# Altium schematic sheet 14_RFPD_PoE_USB_PD.SchDoc: RF power detectors, PoE and USB PD
size A3; Organization: Lime Microsystems; Address1: Surrey Tech Centre; Address2: Guildford GU2 7YG; Address3: Surrey; Address4: United Kingdom; SheetNumber: 14
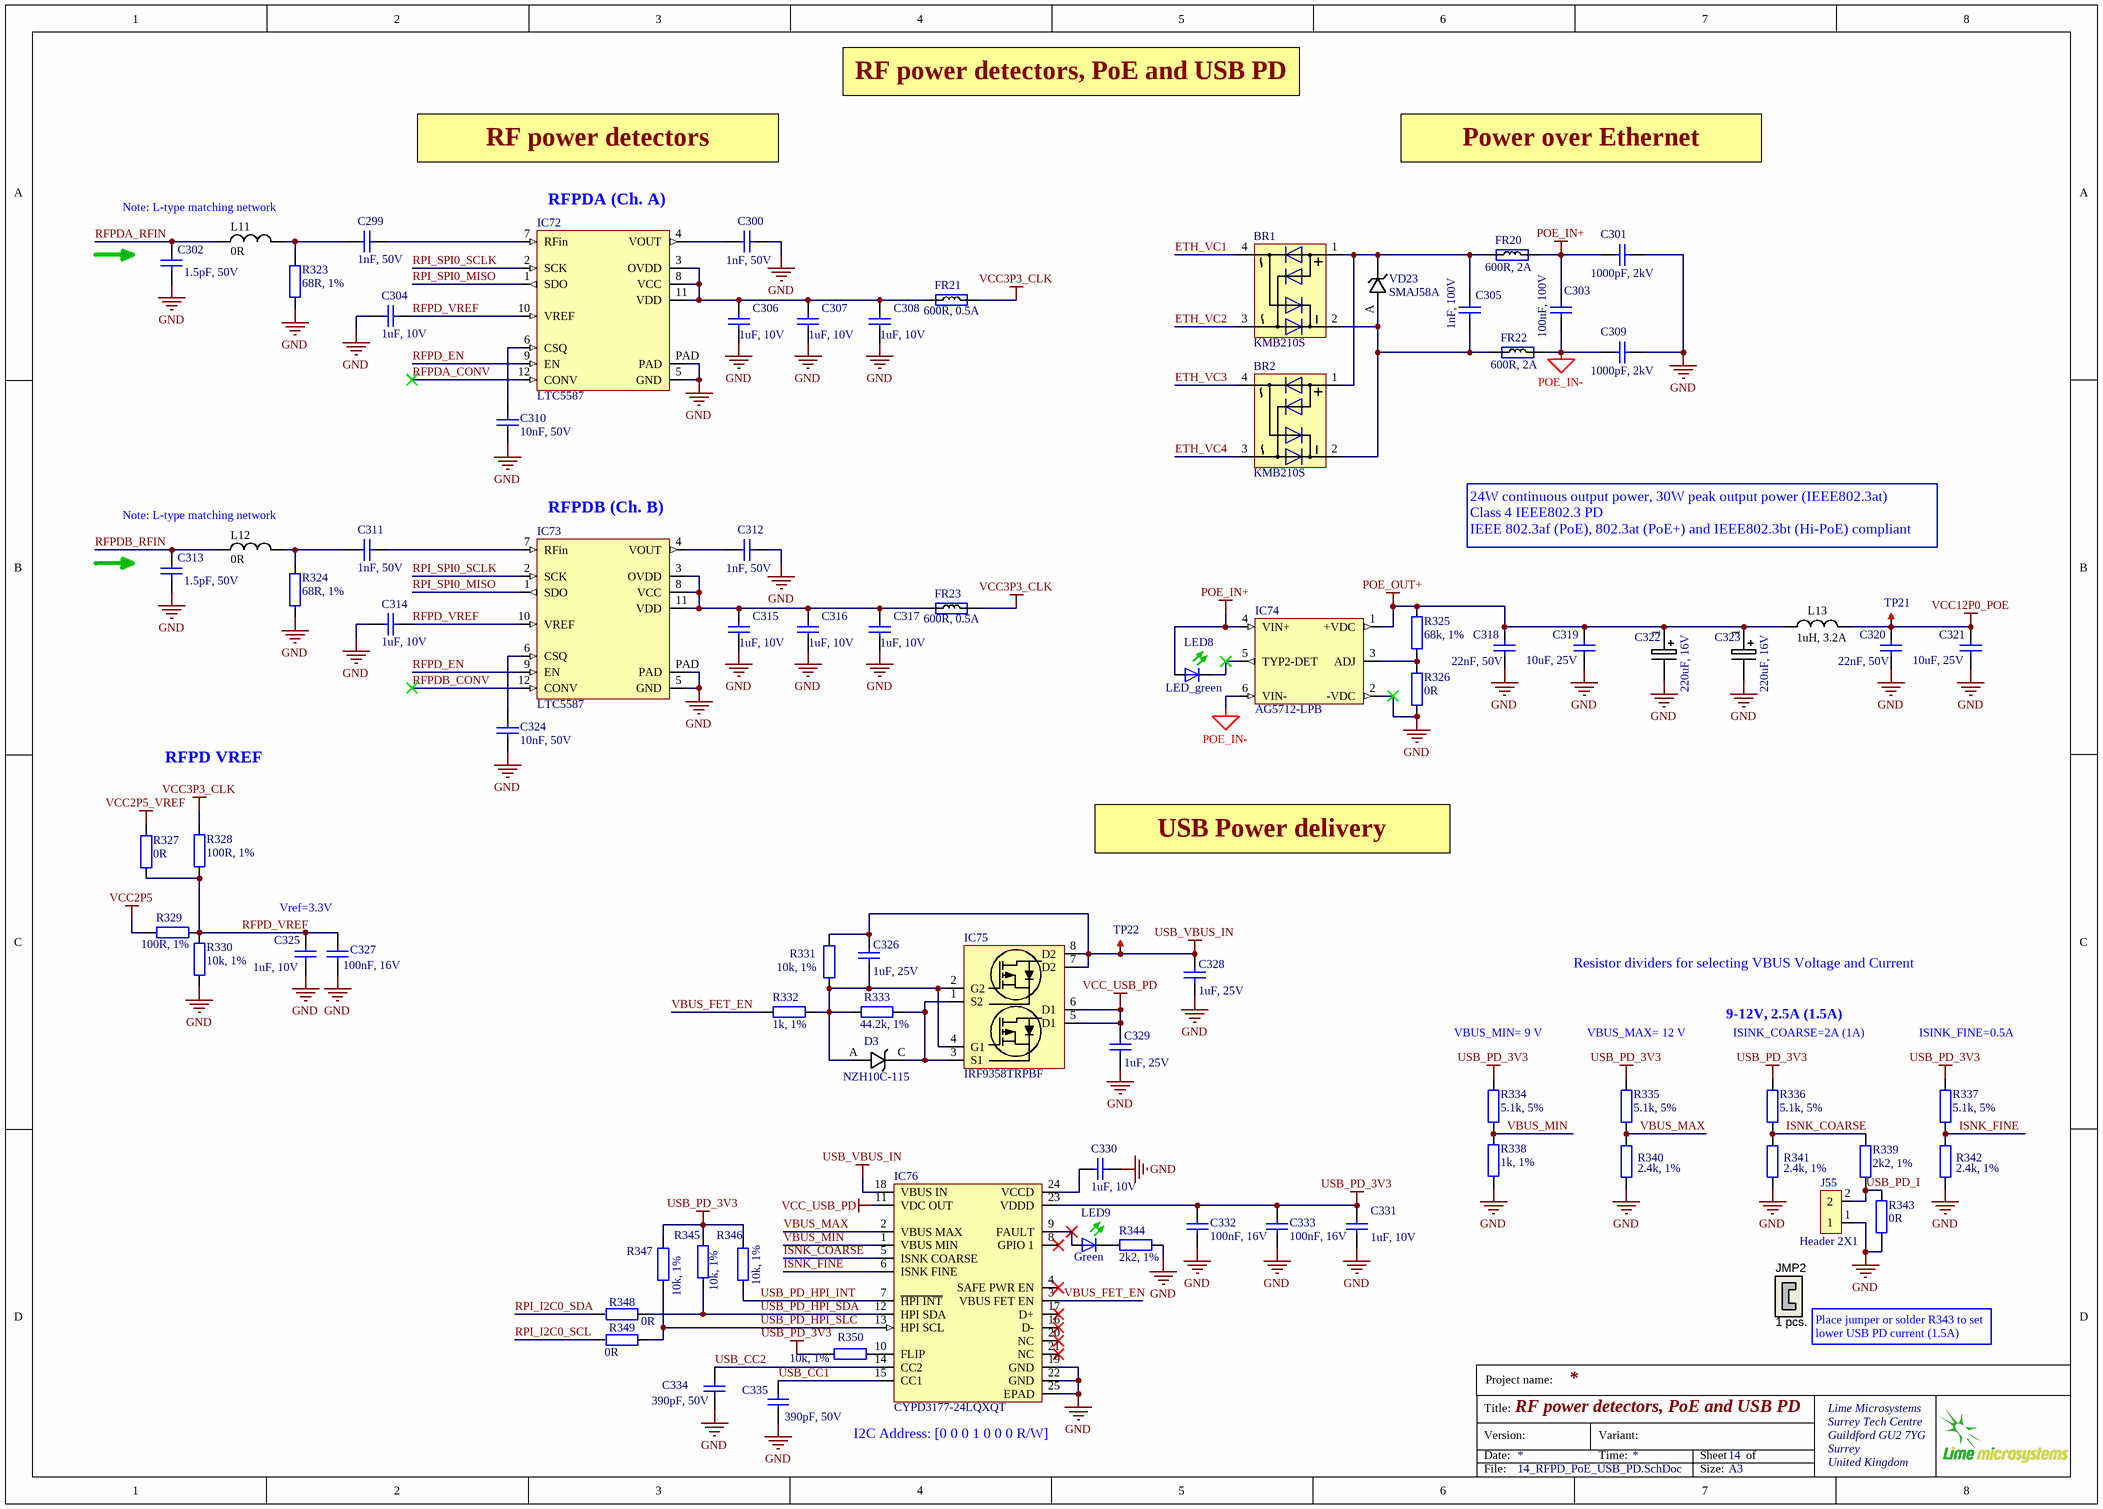
[diagram p0: 14_RFPD_PoE_USB_PD.SchDoc]

## Parts
BR1  KMB210S  [KMB210S_RECTIFIER_BRIDGE]
BR2  KMB210S  [KMB210S_RECTIFIER_BRIDGE]
C299  1nF, 50V  [CAP0402]
C300  1nF, 50V  [CAP0402]
C301  1000pF, 2kV  [CAP1812]
C302  1.5pF, 50V  [CAP0402]
C303  100nF, 100V  [CAP0603]
C304  1uF, 10V  [CAP0402]
C305  1nF, 100V  [CAP0603]
C306  1uF, 10V  [CAP0402]
C307  1uF, 10V  [CAP0402]
C308  1uF, 10V  [CAP0402]
C309  1000pF, 2kV  [CAP1812]
C310  10nF, 50V  [CAP0402]
C311  1nF, 50V  [CAP0402]
C312  1nF, 50V  [CAP0402]
C313  1.5pF, 50V  [CAP0402]
C314  1uF, 10V  [CAP0402]
C315  1uF, 10V  [CAP0402]
C316  1uF, 10V  [CAP0402]
C317  1uF, 10V  [CAP0402]
C318  22nF, 50V  [CAP0402]
C319  10uF, 25V  [CAP0805]
C320  22nF, 50V  [CAP0402]
C321  10uF, 25V  [CAP0805]
C322  220uF, 16V  [CAP_POL_SIZE_F_v2]
C323  220uF, 16V  [CAP_POL_SIZE_F_v2]
C324  10nF, 50V  [CAP0402]
C325  1uF, 10V  [CAP0402]
C326  1uF, 25V  [CAP0603]
C327  100nF, 16V  [CAP0402]
C328  1uF, 25V  [CAP0603]
C329  1uF, 25V  [CAP0603]
C330  1uF, 10V  [CAP0402]
C331  1uF, 10V  [CAP0402]
C332  100nF, 16V  [CAP0402]
C333  100nF, 16V  [CAP0402]
C334  390pF, 50V  [CAP0402]
C335  390pF, 50V  [CAP0402]
D3  NZH10C-115  [NZH10C,115_shottky_diode_SOD123]
FR20  600R, 2A  [RES0805]
FR21  600R, 0.5A  [RES0402]
FR22  600R, 2A  [RES0805]
FR23  600R, 0.5A  [RES0402]
IC72  LTC5587  [LTC5587_DFN12]
IC73  LTC5587  [LTC5587_DFN12]
IC74  AG5712-LPB  [AG5712-LPB_PoE_PD_module]
IC75  IRF9358TRPBF  [IRF9358TRPBF_DUAL_NMOS_SOIC8]
IC76  CYPD3177-24LQXQT  [USB_POWER_DISTR_CYPD3177_QFN24]
J55  Header 2X1  [HDR_1x2]
JMP2  1 pcs.  (mechanical)
L11  0R  [RES0402]
L12  0R  [RES0402]
L13  1uH, 3.2A  [NRS4018T3R3MDGJ_inductor]
LED8  LED_green  [LED-0603-GREEN]
LED9  Green  [LED-0603-GREEN]
R323  68R, 1%  [RES0402]
R324  68R, 1%  [RES0402]
R325  68k, 1%  [RES0402]
R326  0R  [RES0402]
R327  0R  [RES0402_v2]
R328  100R, 1%  [RES0402]
R329  100R, 1%  [RES0402]
R330  10k, 1%  [RES0402]
R331  10k, 1%  [RES0402]
R332  1k, 1%  [RES0402]
R333  44.2k, 1%  [RES0402]
R334  5.1k, 5%  [RES0402]
R335  5.1k, 5%  [RES0402]
R336  5.1k, 5%  [RES0402]
R337  5.1k, 5%  [RES0402]
R338  1k, 1%  [RES0402]
R339  2k2, 1%  [RES0402]
R340  2.4k, 1%  [RES0402]
R341  2.4k, 1%  [RES0402]
R342  2.4k, 1%  [RES0402]
R343  0R  [RES0402]
R344  2k2, 1%  [RES0402]
R345  10k, 1%  [RES0402]
R346  10k, 1%  [RES0402]
R347  10k, 1%  [RES0402]
R348  0R  [RES0402]
R349  0R  [RES0402]
R350  10k, 1%  [RES0402]
TP21  TESTPOINT_PAD  [TP_PAD_1p5MM]  (value not drawn)  (no BOM)
TP22  TESTPOINT_PAD  [TP_PAD_1p5MM]  (value not drawn)  (no BOM)
VD23  SMAJ58A  [SMAJ58A_shottky_diode]

## Nets
GND: C300.1 C301.1 C302.2 C304.2 C306.1 C307.1 C308.1 C309.1 C310.2 C312.1 C313.2 C314.2 C315.1 C316.1 C317.1 C318.2 C319.1 C320.2 C321.1 C322.2 C323.2 C324.2 C325.1 C327.2 C328.1 C329.1 C330.1 C331.1 C332.2 C333.2 C334.2 C335.2 IC72.5(GND) IC72.PAD IC73.5(GND) IC73.PAD IC74.2(-VDC) IC76.19(GND) IC76.22(GND) IC76.25(EPAD) J55.1 R323.2 R324.2 R326.2 R330.2 R338.2 R340.1 R341.1 R342.1 R343.2 R344.2
POE_IN+: C301.2 C303.2 FR20.2 IC74.4(VIN+) LED8.A
POE_IN-: C303.1 C309.2 FR22.2 IC74.6(VIN-)
POE_OUT+: C318.1 C319.2 C322.1 C323.1 IC74.1(+VDC) L13.1 R325.1
USB_PD_3V3: C331.2 C332.1 C333.1 IC76.23(VDDD) R334.1 R335.1 R336.1 R337.1 R345.2 R346.2 R347.2 R350.1
USB_VBUS_IN: C326.2 C328.2 IC75.7(D2) IC75.8(D2) IC76.18(VBUS_IN) R331.2 TP22.1
VCC2P5: R329.2
VCC2P5_VREF: R327.2
VCC3P3_CLK: FR21.2 FR23.2 R328.1
VCC12P0_POE: C320.1 C321.2 L13.2 TP21.1
VCC_USB_PD: C329.2 IC75.5(D1) IC75.6(D1) IC76.11(VDC_OUT)
ETH_VC1: BR1.4
ETH_VC2: BR1.3
ETH_VC3: BR2.4
ETH_VC4: BR2.3
ISNK_COARSE: IC76.5(ISNK_COARSE) R336.2 R339.2 R341.2
ISNK_FINE: IC76.6(ISNK_FINE) R337.2 R342.2
RFPD_EN: IC72.9(EN) IC73.9(EN)
RFPD_VREF: C304.1 C314.1 C325.2 C327.1 IC72.10(VREF) IC73.10(VREF) R327.1 R328.2 R329.1 R330.1
RFPDA_CONV: IC72.12(CONV)
RFPDA_RFIN: C302.1 L11.1
RFPDB_CONV: IC73.12(CONV)
RFPDB_RFIN: C313.1 L12.1
RPI_I2C0_SCL: R349.2
RPI_I2C0_SDA: R348.2
RPI_SPI0_MISO: IC72.1(SDO) IC73.1(SDO)
RPI_SPI0_SCLK: IC72.2(SCK) IC73.2(SCK)
USB_CC1: C335.1 IC76.15(CC1)
USB_CC2: C334.1 IC76.14(CC2)
USB_PD_HPI_INT: IC76.7(~{HPI_INT}) R346.1
USB_PD_HPI_SDA: IC76.12(HPI_SDA) R345.1 R348.1
USB_PD_HPI_SLC: IC76.13(HPI_SCL) R347.1 R349.1
USB_PD_I: J55.2 R339.1 R343.1
VBUS_FET_EN: IC76.3(VBUS_FET_EN) R332.2
VBUS_MAX: IC76.2(VBUS_MAX) R335.2 R340.2
VBUS_MIN: IC76.1(VBUS_MIN) R334.2 R338.1
NetBR1_1: BR1.1 BR2.1 C305.1 FR20.1 VD23.K
NetBR1_2: BR1.2 BR2.2 C305.2 FR22.1 VD23.A
NetC299_1: C299.1 L11.2 R323.1
NetC299_2: C299.2 IC72.7(RFin)
NetC300_2: C300.2 IC72.4(VOUT)
NetC306_2: C306.2 C307.2 C308.2 FR21.1 IC72.3(OVDD) IC72.8(VCC) IC72.11(VDD)
NetC310_1: C310.1 IC72.6(CSQ)
NetC311_1: C311.1 L12.2 R324.1
NetC311_2: C311.2 IC73.7(RFin)
NetC312_2: C312.2 IC73.4(VOUT)
NetC315_2: C315.2 C316.2 C317.2 FR23.1 IC73.3(OVDD) IC73.8(VCC) IC73.11(VDD)
NetC324_1: C324.1 IC73.6(CSQ)
NetC326_1: C326.1 D3.A IC75.2(G2) IC75.4(G1) R331.1 R332.1 R333.2
NetC330_2: C330.2 IC76.24(VCCD)
NetD3_C: D3.C IC75.1(S2) IC75.3(S1) R333.1
NetIC74_3: IC74.3(ADJ) R325.2 R326.1
NetIC74_5: IC74.5(TYP2-DET) LED8.K(C)
NetIC76_9: IC76.9(FAULT) LED9.A
NetIC76_10: IC76.10(FLIP) R350.2
NetLED9_K: LED9.K(C) R344.1

Not connected (* = marked no-connect by the designer): IC76 4(SAFE_PWR_EN)* 8(GPIO_1)* 16(D-)* 17(D+)* 20(NC)* 21(NC)*; JMP2 1 2

## Notes on the sheet
- RF power detectors, PoE and USB PD
- RF power detectors
- Power over Ethernet
- Note: L-type matching network
- (near IC72) RFPDA (Ch. A)
- (near IC73) RFPDB (Ch. B)
- 24W continuous output power, 30W peak output power (IEEE802.3at)
  Class 4 IEEE802.3 PD
  IEEE 802.3af (PoE), 802.3at (PoE+) and IEEE802.3bt (Hi-PoE) compliant
- RFPD VREF
- USB Power delivery
- Vref=3.3V
- Resistor dividers for selecting VBUS Voltage and Current
- (near R334) VBUS_MIN= 9 V
- (near R335) VBUS_MAX= 12 V
- 9-12V, 2.5A (1.5A)
- (near R336) ISINK_COARSE=2A (1A)
- (near R337) ISINK_FINE=0.5A
- Place jumper or solder R343 to set lower USB PD current (1.5A)
- (near IC76) I2C Address: [0 0 0 1 0 0 0 R/W]
- Project name:
- Title:
- Version:
- Date:
- Variant:
- Time:
- Sheet
- of
- File:
- Size:
- A3

## Library data of the parts
BR1 BR2 = KMB210S_RECTIFIER_BRIDGE: Part Description: Bridge Rectifier Single Phase Schottky 100 V Surface Mount MBS; Manufacturer: SMC Diode Solutions; Manufacturer Part Number 1: KMB210S; Supplier Part Number 1: 1655-KMB210SCT-ND; Supplier 1: Digi-Key
C299 C300 C311 C312 = Cap_0402: Manufacturer: Murata Electronics North America; Part Description: 1000pF ±10% 50V Ceramic Capacitor X7R 0402 (1005 Metric); Manufacturer Part Number 1: GCM155R71H102KA37D; Temperature Coefficient: X7R; Tolerance: ±10%; Height - Seated (Max): -; Operating Temperature: -55°C ~ 125°C; Ratings: AEC-Q200; Package / Case: 0402 (1005 Metric); Lead Style: -; Size / Dimension: 0.039" L x 0.020" W (1.00mm x 0.50mm); Lead Spacing: -; Thickness (Max): 0.022" (0.55mm); Mounting Type: Surface Mount, MLCC; Features: -; Voltage - Rated: 50V; Applications: Automotive; Part Status: Active; Packaging: Cut Tape (CT); RoHS: RoHS Compliant; Category: Capacitors; Supplier Part Number 1: 490-4761-1-ND; Supplier 1: Digi-Key; Value: 1nF, 50V
C301 C309 = Cap_1206: Manufacturer Part Number 1: C1812C102KGRACTU; Manufacturer: KEMET; Part Description: 1000pF ±10% 2000V (2kV) Ceramic Capacitor X7R 1812 (4532 Metric); Manufacturer Part Number: C1812C102KGRACAUTO; Tolerance: ±10%; Notification: Current market demand for these product types have resulted in fluctuating and extending lead times. Lead times may differ.; Voltage - Rated: 2000V (2kV); Temperature Coefficient: X7R; Dielectric Material: Ceramic; Capacitance: 1nF; Packaging: Cut Tape (CT); Supplier Part Number 1: 399-3447-1-ND; Supplier 1: Digi-Key; Part Status: Active; Category: Capacitors; RoHS: RoHS Compliant; Mounting Type: Surface Mount, MLCC; Applications: General Purpose; Lead Style: -; Ratings: -; Height - Seated (Max): -; Thickness (Max): 0.061" (1.55mm); Size / Dimension: 0.177" L x 0.126" W (4.50mm x 3.20mm); Package / Case: 1812 (4532 Metric); Failure Rate: -; Lead Spacing: -; Features: High Voltage; Operating Temperature: -55°C ~ 125°C; Value: 1000pF, 2kV; Supplier 2: Digi-Key; Supplier Part Number 2: 399-16774-1-ND; Stock 2: 4004; Pricing 2: 1=0.51, 10=0.355, 100=0.2132, 500=0.1599 (USD); Case/Package: 1812; Weight: 0.000952oz; Case Code (Imperial): 1812; Case Code (Metric): 4532; Min Operating Temperature: -55°C; Max Operating Temperature: 125°C; Voltage Rating (DC): 2kV; Dielectric: X7R; Termination: SMD/SMT; Length: 4.5mm; Width: 3.2mm
C302 C313 = Cap_0402: Manufacturer: Murata; Manufacturer Part Number 1: GRM1555C1H1R5BA01D; Value: 1.5pF, 50V; Supplier 1: Digikey; Supplier Part Number 1: 490-6212-1-ND; Stock 1: 154540; Pricing 1: 1=0,1, 10=0,028, 100=0,0174, 1000=0,01177, 2500=0,01026, 5000=0,0093 (USD); RoHS: Yes; Lead Free: 5697LeadFree; ComponentLink1URL: https://datasheet.ciiva.com/6270/grm1555c1h1r5ba01-01-6270901.pdf?src-supplier=Digikey; ComponentLink1Description: https://datasheet.ciiva.com/6270/grm1555c1h1r5ba01-01-6270901.pdf?src-supplier=Digikey; ComponentLink2URL: https://datasheet.ciiva.com/6270/partnumbering-e-01-6270904.pdf?src-supplier=Digikey; ComponentLink2Description: https://datasheet.ciiva.com/6270/partnumbering-e-01-6270904.pdf?src-supplier=Digikey; ComponentLink3URL: https://datasheet.ciiva.com/6270/partnumbering-e-01-6270907.pdf?src-supplier=Digikey; ComponentLink3Description: https://datasheet.ciiva.com/6270/partnumbering-e-01-6270907.pdf?src-supplier=Digikey; ComponentLink4URL: https://datasheet.ciiva.com/11615/product-11615786.pdf?src-supplier=Avnet; ComponentLink4Description: https://datasheet.ciiva.com/11615/product-11615786.pdf?src-supplier=Avnet
C303 = Cap_0603: Manufacturer: Murata Electronics North America; Manufacturer Part Number 1: GRM188R72A104KA35D; Part Description: 0.1µF ±10% 100V Ceramic Capacitor X7R 0603 (1608 Metric); Temperature Coefficient: X7R; Tolerance: ±10%; Notification: Current market demand for these product types have resulted in fluctuating and extending lead times. Lead times may differ.; Value: 100nF, 100V; RoHS: RoHS Compliant; Packaging: Cut Tape (CT); Lead Spacing: -; Voltage - Rated: 100V; Package / Case: 0603 (1608 Metric); Category: Capacitors; Supplier 1: Digi-Key; Applications: General Purpose; Ratings: -; Part Status: Not For New Designs; Operating Temperature: -55°C ~ 125°C; Lead Style: -; Size / Dimension: 0.063" L x 0.031" W (1.60mm x 0.80mm); Supplier Part Number 1: 490-3285-1-ND; Height - Seated (Max): -; Features: -; Thickness (Max): 0.035" (0.90mm); Mounting Type: Surface Mount, MLCC
C304 C306-C308 C314-C317 C325 C330 C331 = Cap_0402: CAP CER 1UF 10V X5R 0402; Manufacturer: Yageo; Part Description: 1µF 10V Ceramic Capacitor X5R 0402 (1005 Metric) 0.039" L x 0.020" W (1.00mm x 0.50mm); Manufacturer Part Number 1: CC0402MRX5R6BB105; Notification: Current market demand for these product types have resulted in fluctuating and extending lead times. Lead times may differ.; Tolerance: ±20%; Value: 1uF, 10V; Supplier 1: Digi-Key; Supplier Part Number 1: 311-1732-1-ND; RoHS: RoHS Compliant; Applications: General Purpose; Category: Capacitors; ComponentLink1Description: http://www.yageo.com/documents/recent/UPY-GPHC_X5R_4V-to-50V_25.pdf; ComponentLink1URL: http://www.yageo.com/documents/recent/UPY-GPHC_X5R_4V-to-50V_25.pdf; Failure Rate: -; Features: -; Height - Seated (Max): -; Lead Spacing: -; Lead Style: -; Mounting Type: Surface Mount, MLCC; Operating Temperature: -55°C ~ 85°C; Package / Case: 0402 (1005 Metric); Packaging: Cut Tape (CT); Part Status: Active; Pricing 1: 1=0.22, 10=0.156, 100=0.0732, 500=0.0513, 1000=0.04248, 2500=0.03953, 5000=0.03617 (USD); Ratings: -; Size / Dimension: 0.039" L x 0.020" W (1.00mm x 0.50mm); Stock 1: 69600; Temperature Coefficient: X5R; Thickness (Max): 0.022" (0.55mm); Voltage - Rated: 10V
C305 = Cap_0603: Manufacturer: KEMET; Manufacturer Part Number 1: C0603C102K1RACTU; Part Description: 1000pF ±10% 100V Ceramic Capacitor X7R 0603 (1608 Metric); Tolerance: 10%; Dielectric: X7R; Dielectric Material: Ceramic; Value: 1nF, 100V; Radiation Hardening: No; Length: 1.6mm; Mount: Surface Mount; Case/Package: 0603; Width: 0.8mm; Height: 0.8mm; Dissipation Factor: 10%; Package Quantity: 1; Lead Pitch: 0.7mm; Voltage: 100V; Voltage Rating: 100V; Case Code (Metric): 1608; Termination: SMD/SMT; Thickness: 0.034inch; REACH SVHC: No SVHC; Supplier Part Number 1: 399-7831-2-ND; Min Operating Temperature: -55°C; Voltage Rating (DC): 100V; Case Code (Imperial): 0603; Number of Pins: 2; Packaging: Tape and Reel; Capacitance: 1nF; Max Operating Temperature: 125°C; Supplier 1: Digi-Key; Depth: 0.8mm
C310 C324 = Cap_0603: Part Description: 10000pF ±10% 50V X7R Ceramic Capacitor -55°C ~ 125°C Surface Mount, MLCC 0402 (1005 Metric) 0.039" L x 0.020" W (1.00mm x 0.50mm); Manufacturer: Yageo; Tolerance: ±10%; Capacitance: 10000pF; Supplier 1: Digi-Key; Supplier Part Number 1: 311-1349-2-ND; Category: Capacitors; Package / Case: 0402 (1005 Metric); Voltage - Rated: 50V; Value: 10nF, 50V; Manufacturer Part Number 1: *
C318 C320 = Cap_0402: Manufacturer: Kemet; Manufacturer Part Number 1: C0402C223K5RACTU; Part Description: 0.022µF ±10% 50V X7R Ceramic Capacitor -55°C ~ 125°C Surface Mount, MLCC 0402 (1005 Metric) 0.039" L x 0.020" W (1.00mm x 0.50mm); Temperature Coefficient: X7R; Tolerance: ±10%; Capacitance: 0.022µF; Value: 22nF, 50V; Supplier 1: Digi-Key; Supplier Part Number 1: 399-7780-1-ND; Ratings: -; Packaging: Cut Tape (CT); Category: Capacitors; Size / Dimension: 0.039" L x 0.020" W (1.00mm x 0.50mm); RoHS: RoHS Compliant; Operating Temperature: -55°C ~ 125°C; Mounting Type: Surface Mount, MLCC; Applications: General Purpose; Voltage - Rated: 50V; Thickness (Max): 0.022" (0.55mm); Features: -; Height - Seated (Max): -; Lead Style: -; Package / Case: 0402 (1005 Metric); Lead Spacing: -
C319 C321 = Cap_0603: Part Description: CAP CER 10UF 25V X5R 0805; Manufacturer: Murata; Manufacturer Part Number 1: GRM21BR61E106KA73K; Tolerance: 10%; Dielectric: X5R; value: 10uF, 25V; Supplier 1: Digi-Key; Supplier Part Number 1: 490-16824-1-ND; Stock 1: 781136; Pricing 1: 1=0,19, 10=0,13, 50=0,0778, 100=0,0656, 500=0,0449, 1000=0,03972, 2500=0,038, 5000=0,03454 (USD); RoHS: Yes; Mount: Surface Mount; Case/Package: 0805; Weight: 0.000335oz; Case Code (Imperial): 0805; Case Code (Metric): 2012; Min Operating Temperature: -55°C; Max Operating Temperature: 85°C; Packaging: Tape and Reel; Capacitance: 10uF; Voltage Rating: 25V; Package Quantity: 10000; Voltage Rating (DC): 25V; Series: GRM; Length: 0.079inch; Width: 0.049inch; Thickness: 0.055inch; RoHS Compliant: Yes; ComponentLink1URL: http://www.mouser.com/ds/2/281/c02e-2905.pdf?src-supplier=Mouser; ComponentLink1Description: http://www.mouser.com/ds/2/281/c02e-2905.pdf?src-supplier=Mouser; ComponentLink2URL: http://search.murata.co.jp/Ceramy/image/img/A01X/G101/ENG/GRM21BR61E106KA73-01.pdf?src-supplier=Digi-Key; ComponentLink2Description: http://search.murata.co.jp/Ceramy/image/img/A01X/G101/ENG/GRM21BR61E106KA73-01.pdf?src-supplier=Digi-Key; ComponentLink3URL: https://search.murata.co.jp/Ceramy/image/img/A01X/G101/ENG/GRM21BR61E106KA73-01.pdf?src-supplier=Digi-Key; ComponentLink3Description: https://search.murata.co.jp/Ceramy/image/img/A01X/G101/ENG/GRM21BR61E106KA73-01.pdf?src-supplier=Digi-Key
C322 C323 = Cap_ceramic: Part Description: 220 µF 16 V Aluminum - Polymer Capacitors Radial, Can - SMD 30mOhm 5000 Hrs @ 105°C; Manufacturer: Kyocera AVX; Manufacturer Part Number 1: APA0609221M016R; Value: 220uF, 16V; ComponentLink1URL: http://components.arrow.com/part/dataview/41677645S8110057N1386; ComponentLink1Description: http://components.arrow.com/part/dataview/41677645S8110057N1386; ComponentLink2URL: https://www.distrelec.biz/Web/Downloads/_t/ds/PAN-FK_eng_tds.pdf?mime=application%2Fpdf; ComponentLink2Description: https://www.distrelec.biz/Web/Downloads/_t/ds/PAN-FK_eng_tds.pdf?mime=application%2Fpdf; ComponentLink3URL: http://uk.rs-online.com/webdocs/139e/0900766b8139e40f.pdf; ComponentLink3Description: http://uk.rs-online.com/webdocs/139e/0900766b8139e40f.pdf; ComponentLink4URL: http://www.alliedelec.com/m/d/e9dd47fa10a053d1f2828ce8bc944f54.pdf; ComponentLink4Description: http://www.alliedelec.com/m/d/e9dd47fa10a053d1f2828ce8bc944f54.pdf; ComponentLink5URL: https://industrial.panasonic.com/cdbs/www-data/pdf/RDE0000/ABA0000C1181.pdf; ComponentLink5Description: https://industrial.panasonic.com/cdbs/www-data/pdf/RDE0000/ABA0000C1181.pdf; ComponentLink6URL: http://www.farnell.com/datasheets/2002520.pdf; ComponentLink6Description: http://www.farnell.com/datasheets/2002520.pdf; ComponentLink7URL: http://industrial.panasonic.com/www-data/pdf/ABA0000/ABA0000CE120.pdf; ComponentLink7Description: http://industrial.panasonic.com/www-data/pdf/ABA0000/ABA0000CE120.pdf; ComponentLink8URL: http://www.farnell.com/datasheets/731857.pdf; ComponentLink8Description: http://www.farnell.com/datasheets/731857.pdf; ComponentLink9URL: http://www.produktinfo.conrad.com/datenblaetter/425000-449999/443507-da-01-en-SMD_ELKO_VFK_F_22_UF_100V.pdf; ComponentLink9Description: http://www.produktinfo.conrad.com/datenblaetter/425000-449999/443507-da-01-en-SMD_ELKO_VFK_F_22_UF_100V.pdf; ComponentLink10URL: https://industrial.panasonic.com/cdbs/www-data/pdf/RDE0000/DME0000COL90.pdf; ComponentLink10Description: https://industrial.panasonic.com/cdbs/www-data/pdf/RDE0000/DME0000COL90.pdf; ComponentLink11URL: http://www.industrial.panasonic.com/www-data/pdf/ABA0000/ABA0000CE2.pdf; ComponentLink11Description: http://www.industrial.panasonic.com/www-data/pdf/ABA0000/ABA0000CE2.pdf; ComponentLink12URL: http://www.mouser.com/ds/2/315/ABA0000C1145-947633.pdf; ComponentLink12Description: http://www.mouser.com/ds/2/315/ABA0000C1145-947633.pdf; ComponentLink13URL: http://www.farnell.com/datasheets/2648708.pdf; ComponentLink13Description: http://www.farnell.com/datasheets/2648708.pdf; ComponentLink14URL: http://industrial.panasonic.com/www-data/pdf/ABA0000/ABA0000CE2.pdf; ComponentLink14Description: http://industrial.panasonic.com/www-data/pdf/ABA0000/ABA0000CE2.pdf; ComponentLink15URL: http://www.farnell.com/datasheets/1880501.pdf?src-supplier=Farnell; ComponentLink15Description: http://www.farnell.com/datasheets/1880501.pdf?src-supplier=Farnell; ComponentLink16URL: http://www.farnell.com/datasheets/1880501.pdf?src-supplier=Element14; ComponentLink16Description: http://www.farnell.com/datasheets/1880501.pdf?src-supplier=Element14; ComponentLink17URL: https://katalog.we-online.de/pbs/datasheet/875105344010.pdf?src-supplier=Digi-Key; ComponentLink17Description: https://katalog.we-online.de/pbs/datasheet/875105344010.pdf?src-supplier=Digi-Key; ComponentLink18URL: http://katalog.we-online.de/pbs/datasheet/875105344010.pdf?src-supplier=Digi-Key; ComponentLink18Description: http://katalog.we-online.de/pbs/datasheet/875105344010.pdf?src-supplier=Digi-Key; Supplier 1: Digikey; Supplier Part Number 1: 478-APA0609221M016RCT-ND; Stock 1: 757; Pricing 1: 1=0,59, 10=0,352, 50=0,258, 100=0,2288 (USD); RoHS: No
C326 C328 C329 = Cap_0603: Manufacturer: Samsung Electro-Mechanics; Manufacturer Part Number 1: CL10A105KA8NNNC; Part Description: 1µF ±10% 25V Ceramic Capacitor X5R 0603 (1608 Metric); Notification: Current market demand for these product types have resulted in fluctuating and extending lead times. Lead times may differ.; Temperature Coefficient: X5R; Tolerance: ±10%; Lead Spacing: -; Lead Style: -; Thickness (Max): 0.035" (0.90mm); Features: -; Operating Temperature: -55°C ~ 85°C; Size / Dimension: 0.063" L x 0.031" W (1.60mm x 0.80mm); Height - Seated (Max): -; Applications: General Purpose; Mounting Type: Surface Mount, MLCC; Package / Case: 0603 (1608 Metric); Ratings: -; Supplier Part Number 1: 1276-1102-1-ND; Packaging: Cut Tape (CT); Voltage - Rated: 25V; RoHS: RoHS Compliant; Supplier 1: Digi-Key; Category: Capacitors; Part Status: Active; Value: 1uF, 25V
C327 = Cap_0603: Manufacturer Part Number 1: GRM155R71C104KA88D; Part Description: 0.10µF ±10% 16V Ceramic Capacitor X7R 0402 (1005 Metric); Brand: Murata Electronics; Tolerance: 10 %; Type: General Purpose MLCC; Capacitance: 0.1 uF; Temperature Coefficient / Code: +/- 15 %; Case Height: 0.5 mm; Case Length: 1 mm; Dielectric: X7R; Supplier 1: Mouser; Supplier Part Number 1: 81-GRM155R71C104KA88; Case Code - in: 0402; Manufacturer: Murata Electronics; Category: Multilayer Ceramic Capacitors MLCC - SMD/SMT; Voltage Rating DC: 16 V; Value: 100nF, 16V; Manufacturer Part Number: GRM155R71C104KA88D; Case Code - mm: 1005; Case Width: 0.5 mm; Maximum Operating Temperature: + 125 C; Minimum Operating Temperature: - 55 C; Minimum Order Quantity: 1; Operating Temperature Range: - 55 C to + 125 C; Package / Case: 0402 (1005 metric); Packaging: Reel; Product: General Type MLCCs; Product Category: Low & Medium Capacitance SMD Ceramic Chip Capacitors; Reeling: True; RoHS - Mouser: Y; RoHS: RoHS Compliant; Series: GRM; Standard Pack Qty: 10000; Termination Style: SMD/SMT
C332 C333 = Cap_0603: Manufacturer Part Number 1: GRM155R71C104KA88D; Part Description: 0.10µF ±10% 16V Ceramic Capacitor X7R 0402 (1005 Metric); Brand: Murata Electronics; Tolerance: 10 %; Type: General Purpose MLCC; Capacitance: 0.1 uF; Temperature Coefficient / Code: +/- 15 %; Supplier 1: Mouser; Supplier Part Number 1: 81-GRM155R71C104KA88; Case Code - in: 0402; Manufacturer: Murata Electronics; Category: Multilayer Ceramic Capacitors MLCC - SMD/SMT; Voltage Rating DC: 16 V; Value: 100nF, 16V; Maximum Operating Temperature: + 125 C; Minimum Operating Temperature: - 55 C; Minimum Order Quantity: 1; Operating Temperature Range: - 55 C to + 125 C; Package / Case: 0402 (1005 metric); Packaging: Reel; Product: General Type MLCCs; Product Category: Low & Medium Capacitance SMD Ceramic Chip Capacitors; Reeling: True; RoHS - Mouser: Y; RoHS: RoHS Compliant; Series: GRM; Standard Pack Qty: 10000; Termination Style: SMD/SMT; Manufacturer Part Number: GRM155R71C104KA88D
C334 C335 = Cap_0402: Manufacturer: Samsung; Manufacturer Part Number 1: CL05B391KB5NNNC; Part Description: 390 pF ±10% 50V Ceramic Capacitor X7R 0402 (1005 Metric); Tolerance: 10%; Dielectric: X7R; Value: 390pF, 50V; Supplier 1: Digi-Key; Supplier Part Number 1: 1276-1560-1-ND; Stock 1: 1313447; Pricing 1: 1=0,10000, 10=0,03400, 50=0,01860, 100=0,01520, 500=0,01088, 1000=0,00855, 2500=0,00778, 5000=0,00715 (USD); RoHS: Yes; Mount: Surface Mount; Case/Package: 0402; Case Code (Metric): 1005; Case Code (Imperial): 0402; Min Operating Temperature: -55°C; Max Operating Temperature: 125°C; Packaging: Tape and Reel; Capacitance: 390pF; Package Quantity: 1; Voltage Rating: 50V; Voltage: 50V; Series: CL; Construction: Flat; Length: 1mm; Width: 0.02inch; Height: 0.5mm; Thickness: 0.022inch; Depth: 0.5mm; Radiation Hardening: No; RoHS Compliant: Yes; ComponentLink1URL: https://datasheet.ciiva.com/25738/cl05b391kb5nnnc-25738709.pdf?src-supplier=Digi-Key; ComponentLink1Description: https://datasheet.ciiva.com/25738/cl05b391kb5nnnc-25738709.pdf?src-supplier=Digi-Key; ComponentLink2URL: https://datasheet.ciiva.com/26838/getdatasheetpartid-660062-26838242.pdf?src-supplier=Verical; ComponentLink2Description: https://datasheet.ciiva.com/26838/getdatasheetpartid-660062-26838242.pdf?src-supplier=Verical; ComponentLink3URL: https://datasheet.ciiva.com/16202/cl05b104kq5nnnc-16202591.pdf?src-supplier=Future+Electronics; ComponentLink3Description: https://datasheet.ciiva.com/16202/cl05b104kq5nnnc-16202591.pdf?src-supplier=Future+Electronics
D3 = MMSZ5245B_shottky_diode: Part Description: DIODE ZENER 10V 500MW SOD123F; Manufacturer: Nexperia; Manufacturer Part Number 1: NZH10C,115; ComponentLink1URL: http://www.mouser.com/ds/2/427/mmsz5225-102133.pdf; ComponentLink1Description: http://www.mouser.com/ds/2/427/mmsz5225-102133.pdf; ComponentLink2URL: https://datasheet.ciiva.com/331/littelfuse-tvs-diode-smbj-datasheet-pdf-331299.pdf?src-supplier=Digi-Key; ComponentLink2Description: https://datasheet.ciiva.com/331/littelfuse-tvs-diode-smbj-datasheet-pdf-331299.pdf?src-supplier=Digi-Key; ComponentLink3URL: https://datasheet.ciiva.com/331/littelfuse-tvs-diode-smbj-datasheet-pdf-331300.pdf?src-supplier=Digi-Key; ComponentLink3Description: https://datasheet.ciiva.com/331/littelfuse-tvs-diode-smbj-datasheet-pdf-331300.pdf?src-supplier=Digi-Key; ComponentLink4URL: https://datasheet.ciiva.com/331/littelfuse-tvs-diode-smbj-datasheet-pdf-331301.pdf?src-supplier=Digi-Key; ComponentLink4Description: https://datasheet.ciiva.com/331/littelfuse-tvs-diode-smbj-datasheet-pdf-331301.pdf?src-supplier=Digi-Key; Supplier 1: Digi-Key; Supplier Part Number 1: 1727-5057-1-ND; Stock 1: 6768; Pricing 1: 1=0,27000, 10=0,22200, 100=0,11780, 500=0,07752, 1000=0,05271 (USD); RoHS: Yes; RoHS Compliant: Yes; ComponentLink5URL: http://www.farnell.com/datasheets/1508365.pdf?src-supplier=Farnell; ComponentLink5Description: http://www.farnell.com/datasheets/1508365.pdf?src-supplier=Farnell
FR20 FR22 = Ferrite: Manufacturer Part Number 1: MPZ2012S601AT000; Manufacturer: TDK Corporation; Part Description: FERRITE BEAD 600 OHM 0805 1LN; Filter Type: Differential Mode - Single; Impedance @ Frequency: 600 Ohm @ 100MHz; DC Resistance (DCR): 100 mOhm Max; Supplier 1: Digi-Key; Supplier Part Number 1: 445-2206-2-ND; Mounting Type: Surface Mount; RoHS: RoHS Compliant; Height (Max): 0.041" (1.05mm); Packaging: Tape & Reel (TR); Category: Filters; Current Rating: 2A; Package / Case: 0805 (2012 Metric); Size / Dimension: 0.079" L x 0.049" W (2.00mm x 1.25mm); Value: 600R, 2A
FR21 FR23 = Ferrite: Manufacturer: Murata; Manufacturer Part Number 1: BLM15AX601SN1D; Part Description: - Ferrite Bead 0402 (1005 Metric) 500mA 340mOhm; Tolerance: 25%; Current Rating: 500mA; Number of Lines: 1; DC Resistance (DCR): 340mR; Test Frequency: 100MHz; Value: 600R, 0.5A; Supplier 1: Digi-Key; Supplier Part Number 1: 490-5441-1-ND; Stock 1: 416370; Pricing 1: 1=0.1, 10=0.06, 25=0.0552, 50=0.0496, 100=0.0363, 250=0.0264, 500=0.0242, 1000=0.0209, 5000=0.0165 (USD); Case/Package: 0402; Number of Pins: 2; Case Code (Metric): 1005; Case Code (Imperial): 0402; Core Material: Ferrite; Material: Steel,Ferrite; Min Operating Temperature: -55°C; Max Operating Temperature: 125°C; Package Quantity: 1; Packaging: Tape and Reel; Series: BLM15AX_SN; Impedance: 600R; Max Current Rating: 500mA; Termination: SMD/SMT; Max DC Current: 500mA; Number of Circuits: 1; DC Resistance-Max: 340mR; Length: 1mm; Width: 0.5mm; Height: 0.5mm; Depth: 0.5mm; REACH SVHC: No SVHC; Lead Free: Lead Free; RoHS Compliant: Yes; ComponentLink1URL: https://www.murata.com/en-us/products/productdata/8796740059166/ENFA0018.pdf?src-supplier=Digi-Key; ComponentLink1Description: https://www.murata.com/en-us/products/productdata/8796740059166/ENFA0018.pdf?src-supplier=Digi-Key; ComponentLink2URL: http://search.murata.co.jp/Ceramy/image/img/PDF/ENG/L0110S0100BLM15AX_SN.pdf?src-supplier=Future+Electronics; ComponentLink2Description: http://search.murata.co.jp/Ceramy/image/img/PDF/ENG/L0110S0100BLM15AX_SN.pdf?src-supplier=Future+Electronics; ComponentLink3URL: http://www.produktinfo.conrad.com/datenblaetter/1100000-1199999/001171675-da-01-en-CHIP_DROSSEL0402_600R_420MA_1_0X0_5MM.pdf?src-supplier=Conrad; ComponentLink3Description: http://www.produktinfo.conrad.com/datenblaetter/1100000-1199999/001171675-da-01-en-CHIP_DROSSEL0402_600R_420MA_1_0X0_5MM.pdf?src-supplier=Conrad; ComponentLink4URL: http://www.produktinfo.conrad.com/datenblaetter/1100000-1199999/001172169-da-01-en-DROSSEL_0402_600R_1_0X0_5MM_10000ST.pdf?src-supplier=Conrad; ComponentLink4Description: http://www.produktinfo.conrad.com/datenblaetter/1100000-1199999/001172169-da-01-en-DROSSEL_0402_600R_1_0X0_5MM_10000ST.pdf?src-supplier=Conrad
IC72 IC73 = LTC5587: Manufacturer: Linear Technology/Analog Devices; Manufacturer Part Number 1: LTC5587IDD#TRPBF; Part Description: RF Detector IC CDMA, GSM, EDGE, W-CDMA 10MHz ~ 6GHz -34dBm ~ 6dBm ±1dB 12-WFDFN Exposed Pad; Frequency: 10MHz ~ 6GHz; RF Type: CDMA, GSM, EDGE, W-CDMA; Input Range: -34dBm ~ 6dBm; Accuracy: ±1dB; Voltage - Supply: 2.7 V ~ 3.6 V; Supplier 1: Digi-Key; RoHS: RoHS Compliant; Category: RF/IF and RFID; Stock 1: 0; Pricing 1: 2500=6.49745 (USD); Packaging: Tape & Reel (TR); Part Status: Active; Package / Case: 12-WFDFN Exposed Pad; Supplier Device Package: 12-DFN (3x3); ComponentLink1URL: http://www.linear.com/docs/29700; ComponentLink1Description: http://www.linear.com/docs/29700; Supplier Part Number 1: LTC5587IDD#TRPBFTR-ND
IC74 = AG5712-LPB_PoE_PD_module: Part Description: Isolated PoE Module DC DC Converter 1 Output 12V 2.5A 40V - 57V Input; Manufacturer: Silvertel; Supplier 1: Digikey; Supplier Part Number 1: 5061-AG5712-LPB-ND; Manufacturer Part Number 1: AG5712-LPB; Stock 1: 284; Pricing 1: 1=16,85, 10=16,34, 25=16,1, 50=15,5, 72=14,91, 144=14,81007, 288=14,44, 504=13,94004, 1008=12,30009 (USD); RoHS: No
IC75 = IRF9358TRPBF_DUAL_NMOS: Part Description: Mosfet Array 2 P-Channel (Dual) 30V 9.2A 2W Surface Mount 8-SO; Manufacturer: International Rectifier; Element Configuration: Dual; Drain to Source Breakdown Voltage: -30V; Rise Time: 7.2ns; Rds On Max: 16.3mR; Input Capacitance: 1.74nF; Nominal Vgs: -1.8V; Gate to Source Voltage (Vgs): 20V; Power Dissipation: 2W; Drain to Source Voltage (Vdss): 30V; Continuous Drain Current (ID): 9.2A; Turn-On Delay Time: 5.7ns; Turn-Off Delay Time: 146ns; Fall Time: 69ns; Drain to Source Resistance: 23.8mR; Supplier 1: Digi-Key; Supplier Part Number 1: IRF9358TRPBFDKR-ND; Manufacturer Part Number 1: IRF9358TRPBF; Stock 1: 0; RoHS: Yes; Mount: Surface Mount; Case/Package: SOIC; Number of Pins: 8; Min Operating Temperature: -55°C; Max Operating Temperature: 150°C; Package Quantity: 1; Packaging: Tape and Reel; Max Power Dissipation: 2W; Length: 5mm; Width: 4mm; Height: 1.5mm; Radiation Hardening: No; REACH SVHC: No SVHC; ComponentLink1URL: https://datasheet.ciiva.com/7798/irf9358pbf-7798959.pdf?src-supplier=Element14; ComponentLink1Description: https://datasheet.ciiva.com/7798/irf9358pbf-7798959.pdf?src-supplier=Element14; ComponentLink2URL: https://datasheet.ciiva.com/929/irf9358pbf-929243.pdf?src-supplier=Digi-Key; ComponentLink2Description: https://datasheet.ciiva.com/929/irf9358pbf-929243.pdf?src-supplier=Digi-Key; ComponentLink3URL: https://datasheet.ciiva.com/929/irf9358pbf-929244.pdf?src-supplier=Digi-Key; ComponentLink3Description: https://datasheet.ciiva.com/929/irf9358pbf-929244.pdf?src-supplier=Digi-Key; ComponentLink4URL: https://datasheet.ciiva.com/929/irf9358pbf-929245.pdf?src-supplier=Digi-Key; ComponentLink4Description: https://datasheet.ciiva.com/929/irf9358pbf-929245.pdf?src-supplier=Digi-Key
IC76 = USB_POWER_DISTR_CYPD3177-24LQXQT: Part Description: 428-CYPD3177-24LQXQTCT-ND; Manufacturer: Cypress; Supplier 1: Digi-Key; Supplier Part Number 1: 428-CYPD3177-24LQXQTCT-ND; Manufacturer Part Number 1: CYPD3177-24LQXQT; Stock 1: 19489; Pricing 1: 1=2,31000, 10=2,07900, 25=1,96080, 100=1,67080, 250=1,56880, 500=1,37270, 1000=1,13738 (USD); RoHS: No
J55 = Jumper: Manufacturer Part Number 1: 961102-6404-AR; Part Description: 2 Positions Header, Unshrouded Connector 0.100" (2.54mm) Through Hole Gold; Manufacturer: 3M; Connector Type: Header, Unshrouded; Supplier 1: Digi-Key; Supplier Part Number 1: 3M9447-ND; Contact Type: Male Pin; Color: Black; Mounting Type: Through Hole; Category: Connectors, Interconnects; Contact Finish: Gold
JMP2 = JUMP_2P_CONN_HEADER: Shorting Jumper, 2-position, 1.27mm pitch; Part Description: 2 (1 x 2) Position Shunt Connector Black Closed Top 0.100" (2.54mm) Gold; Manufacturer: Sullins; Manufacturer Part Number 1: SPC02SYAN; Number of Positions: 2; Pitch: 0.1inch; Supplier 1: Digi-Key; Supplier Part Number 1: S9001-ND; Stock 1: 570741; Pricing 1: 1=0.1, 10=0.059, 25=0.044, 50=0.0378, 100=0.0365, 250=0.03152, 500=0.03024, 1000=0.02646, 2500=0.02394 (USD); Colour: Black; Contact Plating: Gold; Package Quantity: 1000; Packaging: Bulk; Height: 0.256inch; Lead Free: Lead Free; ComponentLink1URL: http://www.sullinscorp.com/images/SPC02SYAN-0-3293.pdf; ComponentLink1Description: http://www.sullinscorp.com/images/SPC02SYAN-0-3293.pdf; ComponentLink2URL: https://drawings-pdf.s3.amazonaws.com/11134.pdf; ComponentLink2Description: https://drawings-pdf.s3.amazonaws.com/11134.pdf
L11 L12 = Inductor_0603: Manufacturer: Yageo; Part Description: RES SMD 0.0OHM JUMPER 1/16W 0402; Manufacturer Part Number 1: RC0402JR-070RL; Power (Watts): 0.063W, 1/16W; Resistance (Ohms): 0.0; Tolerance: Jumper; Supplier 1: Digi-Key; Supplier Part Number 1: 311-0.0JRTR-ND; Packaging: Tape & Reel (TR); RoHS: RoHS Compliant; value: 0R; Category: Resistors; Composition: Thick Film; Features: Moisture Resistant; Height: 0.016" (0.40mm); Number of Terminations: 2; Operating Temperature: -55°C ~ 155°C; Package / Case: 0402 (1005 Metric); Size / Dimension: 0.039" L x 0.020" W (1.00mm x 0.50mm); Supplier Device Package: 0402; Temperature Coefficient: -
L13 = Inductor_0603: Manufacturer: Taiyo Yuden; Manufacturer Part Number 1: NRS4018T1R0NDGJ; Part Description: 1 µH Shielded Drum Core, Wirewound Inductor 3.2 A 32.4mOhm Max Nonstandard; Core Material: Ferrite; Self Resonant Frequency: 90MHz; Tolerance: 30%; Saturation Current: 4A; Shielding: Shielded; DC Resistance (DCR): 32.4mR; Test Frequency: 100kHz; ComponentLink1URL: https://www.yuden.co.jp/productdata/catalog/en/wound04_e.pdf; ComponentLink1Description: https://www.yuden.co.jp/productdata/catalog/en/wound04_e.pdf; ComponentLink2URL: http://uk.rs-online.com/webdocs/10b3/0900766b810b3cd2.pdf; ComponentLink2Description: http://uk.rs-online.com/webdocs/10b3/0900766b810b3cd2.pdf; Supplier 1: Digi-Key; Supplier Part Number 1: 587-2888-1-ND; Stock 1: 277625; Pricing 1: 1=0,27000, 10=0,23800, 25=0,20840, 50=0,17860, 100=0,16370, 250=0,14884, 500=0,13990, 1000=0,10716 (USD); RoHS: Yes; Mount: Surface Mount; Case/Package: Nonstandard; Number of Pins: 2; Min Operating Temperature: -25°C; Max Operating Temperature: 125°C; Packaging: Cut Tape; Inductance: 1uH; Package Quantity: 3500; Current Rating: 3.2A; Inductance Tolerance: 30%; Resistor Type: Wirewound; Max DC Current: 4A; Termination: SMD/SMT; RMS Current (Irms): 3.2A; Series: NRS; Length: 4mm; Width: 0.157inch; Height: 1.8mm; Height - Seated (Max): 0.071inch; Depth: 4.2mm; Lead Pitch: 2.8mm; Radiation Hardening: No; Lead Free: Lead Free; Halogen Free: Halogen Free; REACH SVHC: Unknown; RoHS Compliant: Yes; ComponentLink3URL: https://datasheet.ciiva.com/1043/nrs4018t1r0ndgj-ss-1043587.pdf?src-supplier=Digi-Key; ComponentLink3Description: https://datasheet.ciiva.com/1043/nrs4018t1r0ndgj-ss-1043587.pdf?src-supplier=Digi-Key; ComponentLink4URL: https://datasheet.ciiva.com/25607/0900766b810b3cd2-25607942.pdf?src-supplier=RSComponents; ComponentLink4Description: https://datasheet.ciiva.com/25607/0900766b810b3cd2-25607942.pdf?src-supplier=RSComponents; ComponentLink5URL: https://datasheet.ciiva.com/8504/nrs4018t1r0ndgj-ss-8504305.pdf?src-supplier=Avnet; ComponentLink5Description: https://datasheet.ciiva.com/8504/nrs4018t1r0ndgj-ss-8504305.pdf?src-supplier=Avnet; Value: 1uH, 3.2A
LED8 = LED_green: Part Description: Green 572nm LED Indication - Discrete 2.2V 0603 (1608 Metric); Manufacturer Part Number 1: HSMG-C190; Manufacturer: Avago Technologies US Inc.; Current - Test: 20mA; Voltage - Forward (Vf) (Typ): 2.2V; Color: Green; Supplier 1: Digi-Key; Supplier Part Number 1: 516-1425-2-ND; Category: Optoelectronics; Package / Case: 0603 (1608 Metric)
LED9 = LED_green: Part Description: Green 572nm LED Indication - Discrete 2.2V 0603 (1608 Metric); Manufacturer Part Number 1: HSMG-C190; Manufacturer: Avago Technologies US Inc.; Current - Test: 20mA; Voltage - Forward (Vf) (Typ): 2.2V; Supplier 1: Digi-Key; Supplier Part Number 1: 516-1425-2-ND; Category: Optoelectronics; Color: Green; Package / Case: 0603 (1608 Metric)
R323 R324 = Res_0402: Part Description: 68 Ohms ±1% 0.063W, 1/16W Chip Resistor 0402 (1005 Metric) Moisture Resistant Thick Film; Manufacturer: Yageo; Manufacturer Part Number 1: RC0402FR-0768RL; Power (Watts): 0.063W, 1/16W; Temperature Coefficient: ±100ppm/°C; Value: 68R, 1%; Supplier 1: Digi-Key; Supplier Part Number 1: 311-68.0LRCT-ND; RoHS: RoHS Compliant; Category: Resistors; Stock 1: 1011982; Pricing 1: 1=0.1, 10=0.014, 100=0.0056, 1000=0.00253, 2500=0.0022, 5000=0.00181 (USD); Packaging: Cut Tape (CT); Part Status: Active; Tolerance: ±1%; Composition: Thick Film; Features: Moisture Resistant; Operating Temperature: -55°C ~ 155°C; Package / Case: 0402 (1005 Metric); Supplier Device Package: 0402; Size / Dimension: 0.039" L x 0.020" W (1.00mm x 0.50mm); Height - Seated (Max): 0.016" (0.40mm); Failure Rate: -; ComponentLink1URL: http://www.yageo.com/documents/recent/PYu-RC_Group_51_RoHS_L_9.pdf; ComponentLink1Description: http://www.yageo.com/documents/recent/PYu-RC_Group_51_RoHS_L_9.pdf
R325 = Res_0402: Part Description: 68 kOhms ±1% 0.063W, 1/16W Chip Resistor 0402 (1005 Metric) Moisture Resistant Thick Film; Manufacturer: Yageo; Manufacturer Part Number 1: RC0402FR-0768KL; Resistance: 68kR; Power Rating: 63mW; Voltage Rating: 50V; Temperature Coefficient: 100ppm/°C; Value: 68k, 1%; ComponentLink1URL: https://datasheet.ciiva.com/12576/pyu-ac-51-rohs-l-2-12576779.pdf?src-supplier=Mouser; ComponentLink1Description: https://datasheet.ciiva.com/12576/pyu-ac-51-rohs-l-2-12576779.pdf?src-supplier=Mouser; Supplier 1: Digikey; Supplier Part Number 1: 311-68.0KLRCT-ND; Stock 1: 520340; Pricing 1: 1=0,1, 10=0,009, 50=0,0072, 500=0,0051, 5000=0,00306 (USD); RoHS: Yes; Case/Package: 0402; Case Code (Metric): 1005; Case Code (Imperial): 0402; Size Code: 0402; Min Operating Temperature: -55°C; Max Operating Temperature: 155°C; Package Quantity: 1; Tolerance: 1%; Packaging: Tape and Reel; Resistor Type: Thick Film; Number of Terminations: 2; Termination: SMD/SMT; Max Power Dissipation: 63mW; Features: Moisture Resistant; Series: RC; Construction: Rectangular; Resistance Tolerance: 1%; Voltage Rating (AC): 50V; Length: 0.039inch; Width: 0.02inch; Height: 0.016inch; Depth: 0.5mm; Military Standard: Not; RoHS Compliant: Yes; Reach SVHC Compliant: Unknown; Lead Free: 5697LeadFree; ComponentLink2URL: https://datasheet.ciiva.com/2553/pyu-r-int-thick-7-2553216.pdf?src-supplier=Digikey; ComponentLink2Description: https://datasheet.ciiva.com/2553/pyu-r-int-thick-7-2553216.pdf?src-supplier=Digikey; ComponentLink3URL: https://datasheet.ciiva.com/2553/pyu-r-int-thick-7-2553217.pdf?src-supplier=Digikey; ComponentLink3Description: https://datasheet.ciiva.com/2553/pyu-r-int-thick-7-2553217.pdf?src-supplier=Digikey; ComponentLink4URL: https://datasheet.ciiva.com/2553/pyu-r-int-thick-7-2553215.pdf?src-supplier=Digikey; ComponentLink4Description: https://datasheet.ciiva.com/2553/pyu-r-int-thick-7-2553215.pdf?src-supplier=Digikey; ComponentLink5URL: https://datasheet.ciiva.com/7850/1018594-7850072.pdf?src-supplier=Element14; ComponentLink5Description: https://datasheet.ciiva.com/7850/1018594-7850072.pdf?src-supplier=Element14; ComponentLink6URL: https://datasheet.ciiva.com/7850/1018594-7850073.pdf?src-supplier=Element14; ComponentLink6Description: https://datasheet.ciiva.com/7850/1018594-7850073.pdf?src-supplier=Element14; ComponentLink7URL: https://datasheet.ciiva.com/16781/pyu-rc0402-51-rohs-l-6-r-16781001.pdf?src-supplier=Future+Electronics; ComponentLink7Description: https://datasheet.ciiva.com/16781/pyu-rc0402-51-rohs-l-6-r-16781001.pdf?src-supplier=Future+Electronics
R326 R327 R343 R348 R349 = Res_0402: Manufacturer Part Number 1: RC0402JR-070RL; Manufacturer: Yageo; Part Description: RES SMD 0.0OHM JUMPER 1/16W 0402; Resistance (Ohms): 0.0; Tolerance: Jumper; Power (Watts): 0.063W, 1/16W; Value: 0R; Supplier 1: Digi-Key; Supplier Part Number 1: 311-0.0JRTR-ND; Category: Resistors; Temperature Coefficient: -; Features: Moisture Resistant; Supplier Device Package: 0402; Height: 0.016" (0.40mm); Package / Case: 0402 (1005 Metric); Operating Temperature: -55°C ~ 155°C; Size / Dimension: 0.039" L x 0.020" W (1.00mm x 0.50mm); Composition: Thick Film; Packaging: Tape & Reel (TR); Number of Terminations: 2; RoHS: RoHS Compliant
R328 R329 = Res_0402: Manufacturer Part Number 1: RMCF0402FT100R; Manufacturer: Stackpole Electronics Inc.; Part Description: RES SMD 100 OHM 1% 1/16W 0402; Power (Watts): 0.063W, 1/16W; Temperature Coefficient: ±100ppm/°C; Resistance (Ohms): 100; Value: 100R, 1%; Supplier 1: Digi-Key; Supplier Part Number 1: RMCF0402FT100RDKR-ND; Packaging: Digi-Reel®; Composition: Thick Film; Number of Terminations: 2; Package / Case: 0402 (1005 Metric); RoHS: RoHS Compliant; Category: Resistors; Size / Dimension: 0.039" L x 0.020" W (1.00mm x 0.50mm); Tolerance: ±1%; Supplier Device Package: 0402; Features: -; Height: 0.016" (0.40mm); Operating Temperature: -55°C ~ 155°C
R330 R331 R345-R347 R350 = Res_0402: Manufacturer: Yageo; Manufacturer Part Number 1: RC0402FR-0710KL; Part Description: RES SMD 10K OHM 1% 1/16W 0402; Temperature Coefficient: ±100ppm/°C; Power (Watts): 0.063W, 1/16W; Value: 10k, 1%; Supplier 1: Digi-Key; Supplier Part Number 1: 311-10.0KLRTR-ND; Resistance (Ohms): 10k; Packaging: Tape & Reel (TR); RoHS: RoHS Compliant; Package / Case: 0402 (1005 Metric); Tolerance: ±1%; Operating Temperature: -55°C ~ 155°C; Size / Dimension: 0.039" L x 0.020" W (1.00mm x 0.50mm); Number of Terminations: 2; Category: Resistors; Height: 0.016" (0.40mm); Supplier Device Package: 0402; Features: Moisture Resistant; Composition: Thick Film
R332 R338 = Res_0402: Manufacturer: Stackpole Electronics Inc; Manufacturer Part Number 1: RMCF0402FT1K00; Part Description: RES SMD 1K OHM 1% 1/16W 0402; Temperature Coefficient: ±100ppm/°C; Power (Watts): 0.063W, 1/16W; Value: 1k, 1%; Supplier 1: Digi-Key; Supplier Part Number 1: RMCF0402FT1K00TR-ND; Package / Case: 0402 (1005 Metric); Supplier Device Package: 0402; Height: 0.016" (0.40mm); Size / Dimension: 0.039" L x 0.020" W (1.00mm x 0.50mm); Number of Terminations: 2; Packaging: Cut Tape (CT); Category: Resistors; Composition: Thick Film; Resistance (Ohms): 1k; Tolerance: ±1%; Features: Moisture Resistant; Operating Temperature: -55°C ~ 155°C; RoHS: RoHS Compliant
R333 = Res_0402: Manufacturer Part Number 1: ERJ-2RKF4422X; Manufacturer: Panasonic Electronic Components; Part Description: RES SMD 44.2K OHM 1% 1/10W 0402; Power (Watts): 0.1W, 1/10W; Temperature Coefficient: ±100ppm/°C; Value: 44.2k, 1%; Supplier 1: Digi-Key; Supplier Part Number 1: P44.2KLCT-ND; Tolerance: ±1%; Supplier Device Package: 0402; Packaging: Cut Tape (CT); Size / Dimension: 0.039" L x 0.020" W (1.00mm x 0.50mm); Features: Automotive AEC-Q200; Package / Case: 0402 (1005 Metric); Height: 0.016" (0.40mm); Operating Temperature: -55°C ~ 155°C; Number of Terminations: 2; Composition: Thick Film; Resistance (Ohms): 44.2k; RoHS: RoHS Compliant; Category: Resistors
R334-R337 = Res_0603: Part Description: RES 5.1K OHM 5% 1/16W 0402; Manufacturer: Yageo; Manufacturer Part Number 1: RC0402JR-075K1L; Voltage Rating: 50V; Resistance: 5.1kR; Power Rating: 62.5mW; Temperature Coefficient: 100ppm/°C; Max Power Dissipation: 63mW; Supplier 1: Digi-Key; Supplier Part Number 1: 311-5.1KJRCT-ND; Stock 1: 1066675; Pricing 1: 1=0,10000, 10=0,01300, 100=0,00520, 1000=0,00233, 2500=0,00202, 5000=0,00167 (USD); RoHS: Yes; Case/Package: 0402; Case Code (Imperial): 0402; Case Code (Metric): 1005; Weight: 2.3E-05oz; Size Code: 0402; Min Operating Temperature: -55°C; Max Operating Temperature: 155°C; Packaging: Tape and Reel; Tolerance: 5%; Resistor Type: Thick Film; Termination: SMD/SMT; Voltage Rating (DC): 50V; Features: Moisture Resistant; Series: RC; Number of Terminations: 2; Construction: Rectangular; Resistance Tolerance: 5%; Length: 1mm; Width: 0.5mm; Height: 0.35mm; Depth: 0.5mm; REACH SVHC: No SVHC; Military Standard: Not; Lead Free: Lead Free; RoHS Compliant: Yes; ComponentLink1URL: https://datasheet.ciiva.com/7983/1018594-7983595.pdf?src-supplier=Element14; ComponentLink1Description: https://datasheet.ciiva.com/7983/1018594-7983595.pdf?src-supplier=Element14; ComponentLink2URL: https://datasheet.ciiva.com/16740/pyu-rc0402-51-rohs-l-6-r-16740925.pdf?src-supplier=Future+Electronics; ComponentLink2Description: https://datasheet.ciiva.com/16740/pyu-rc0402-51-rohs-l-6-r-16740925.pdf?src-supplier=Future+Electronics
R339 R344 = Res_0402: Manufacturer: Stackpole Electronics Inc; Manufacturer Part Number 1: RMCF0402FT2K20; Part Description: RES SMD 2.2K OHM 1% 1/16W 0402; Resistance (Ohms): 2.2k; Temperature Coefficient: ±100ppm/°C; Power (Watts): 0.063W, 1/16W; Value: 2k2, 1%; Supplier 1: Digi-Key; Supplier Part Number 1: RMCF0402FT2K20CT-ND; Supplier Device Package: 0402; Package / Case: 0402 (1005 Metric); Size / Dimension: 0.039" L x 0.020" W (1.00mm x 0.50mm); Operating Temperature: -55°C ~ 155°C; Composition: Thick Film; Category: Resistors; Features: -; Height: 0.016" (0.40mm); RoHS: RoHS Compliant; Number of Terminations: 2; Packaging: Cut Tape (CT); Tolerance: ±1%
R340-R342 = Res_0402: Manufacturer Part Number 1: RC0402FR-072K4L; Manufacturer: Yageo; Part Description: 2.4 kOhms ±1% 0.063W, 1/16W Chip Resistor 0402 (1005 Metric) Moisture Resistant Thick Film; Temperature Coefficient: ±100ppm/°C; Power (Watts): 0.063W, 1/16W; Value: 2.4k, 1%; Package / Case: 0402 (1005 Metric); RoHS: RoHS Compliant; Supplier Part Number 1: 311-2.40KLRCT-ND; Resistance (Ohms): 2.4k; Size / Dimension: 0.039" L x 0.020" W (1.00mm x 0.50mm); Category: Resistors; Part Status: Active; Features: Moisture Resistant; Supplier Device Package: 0402; Failure Rate: -; Tolerance: ±1%; Composition: Thick Film; Packaging: Cut Tape (CT); Operating Temperature: -55°C ~ 155°C; Height - Seated (Max): 0.016" (0.40mm); Supplier 1: Digi-Key
TP21 TP22 = TESTPOINT_PAD: Test Point PCB mount Miniature White
VD23 = DIODE_TVS_UNIDIR: Manufacturer: Diodes Incorporated; Manufacturer Part Number 1: SMAJ58A-13-F; Part Description: TVS DIODE 58V 93.6V SMA; Current - Peak Pulse (10/1000µs): 4.3A; Power - Peak Pulse: 400W; Power Line Protection: No; Type: Zener; Voltage - Breakdown (Min): 64.4V; Voltage - Clamping (Max) @ Ipp: 93.6V; Voltage - Reverse Standoff (Typ): 58V; Applications: General Purpose; Base Part Number: SMAJ58; Capacitance @ Frequency: -; Category: Circuit Protection; Mounting Type: Surface Mount; Operating Temperature: -55°C ~ 150°C (TJ); Package / Case: DO-214AC, SMA; Packaging: Cut Tape (CT); Part Status: Active; RoHS: RoHS Compliant; Supplier 1: Digi-Key; Supplier Device Package: SMA; Supplier Part Number 1: SMAJ58A-13-FDICT-ND; Value: SMAJ58A